# EAGLE schematic Mtx12BR_v1.1 (EAGLE 7.5.0)
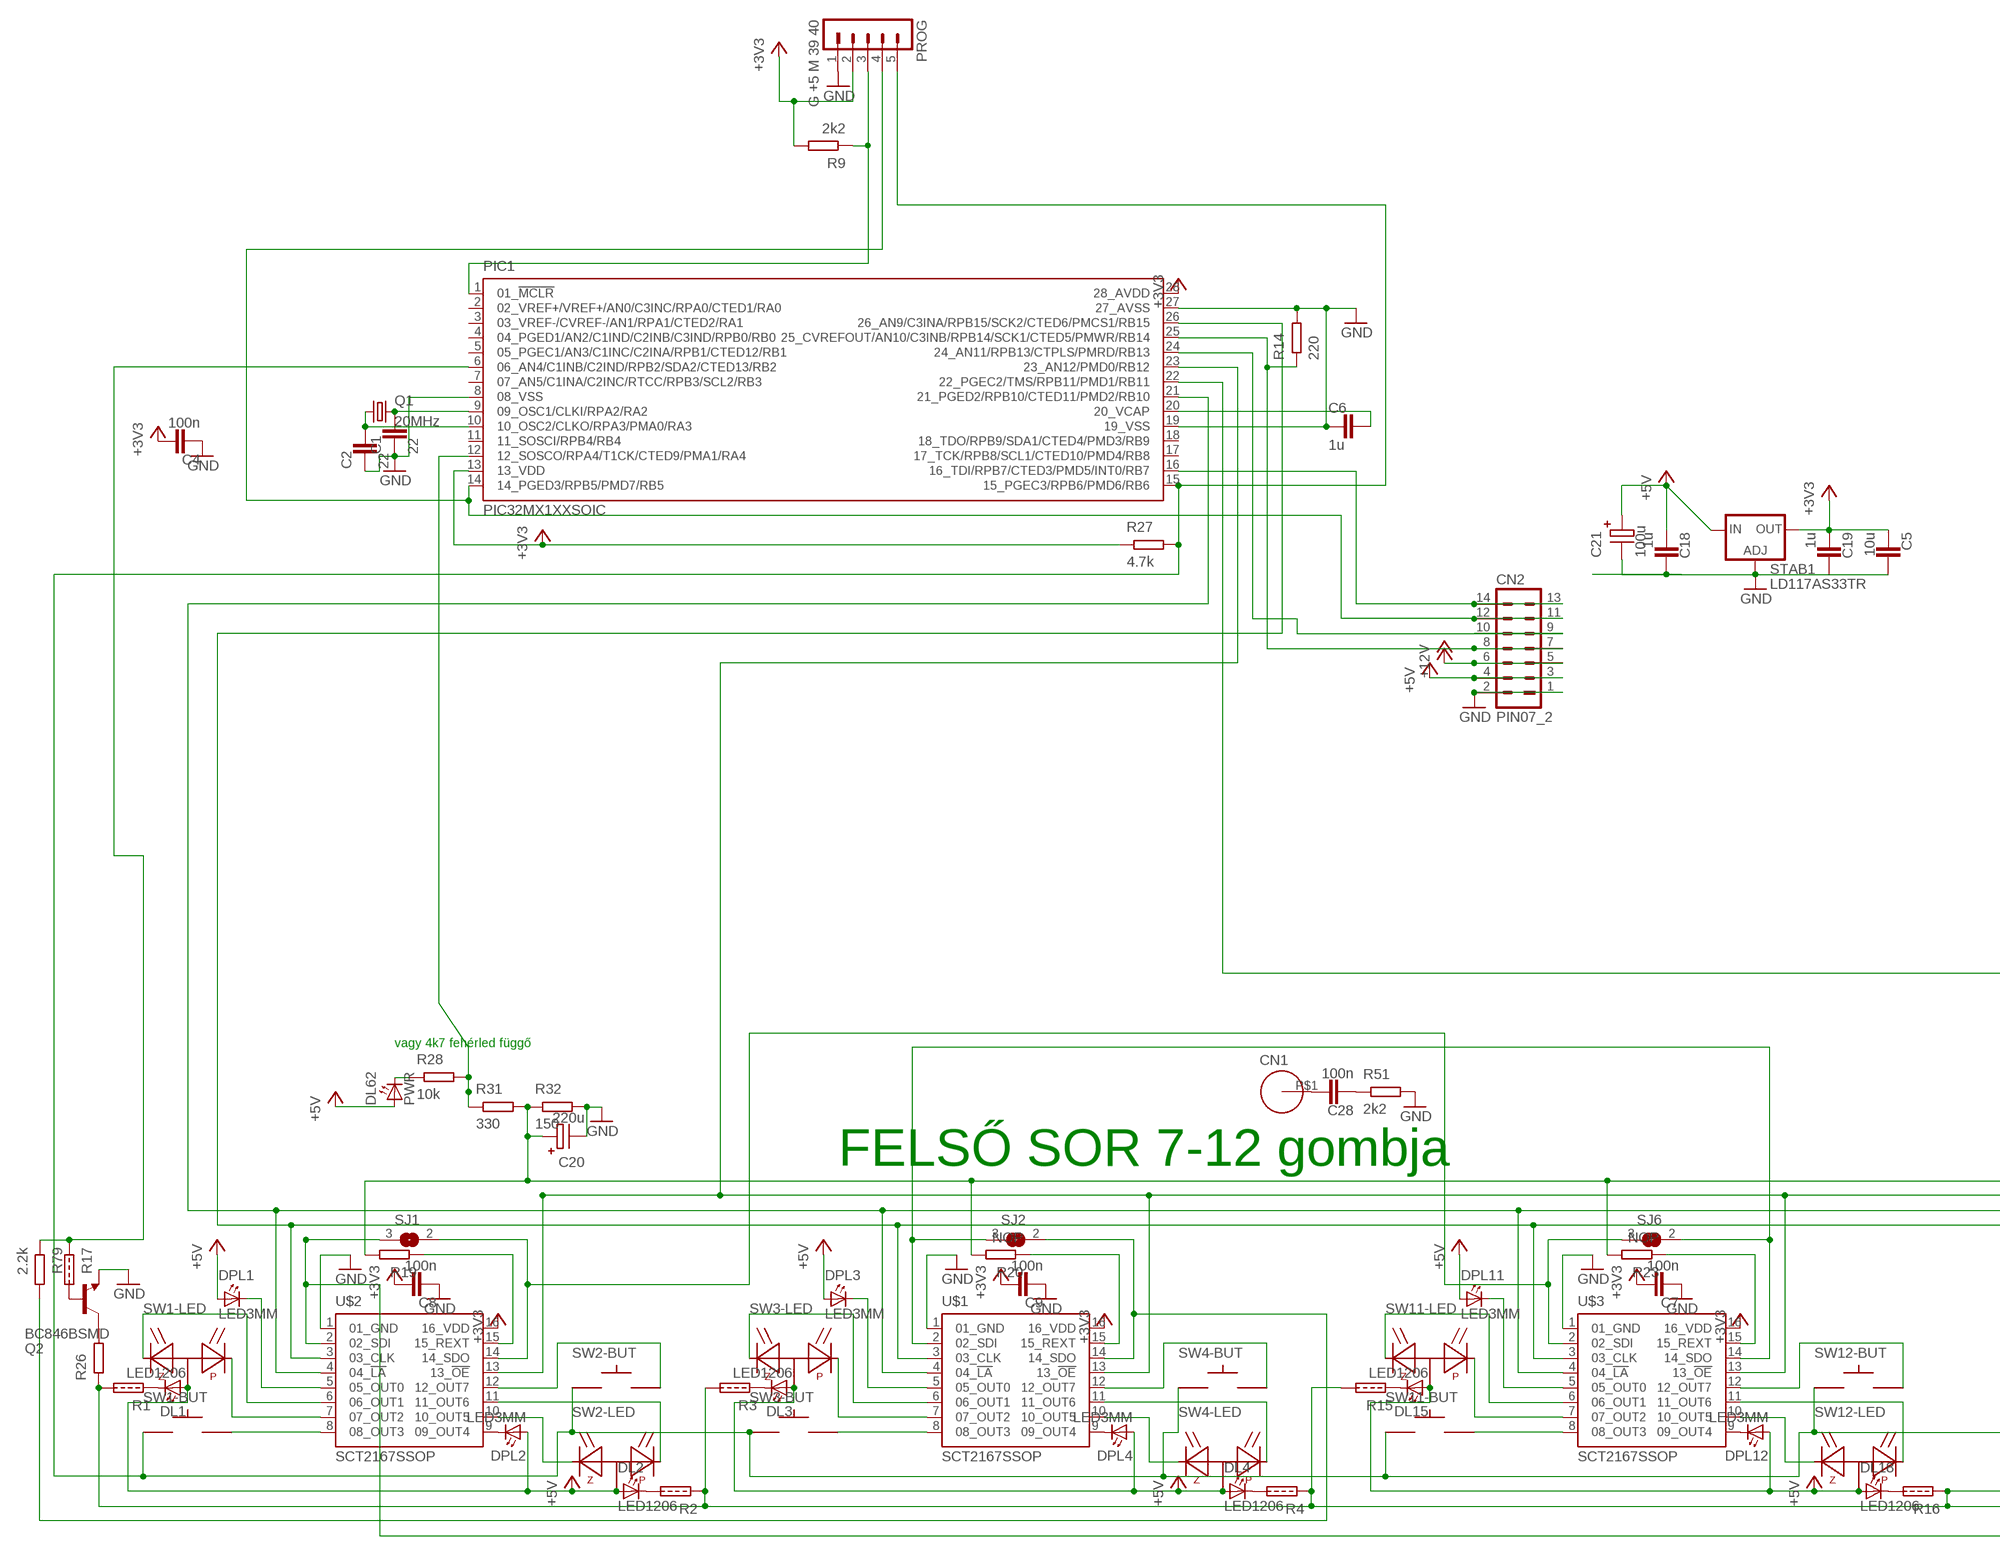
[diagram p0: schematic, sheet 1, part 1 of 2]
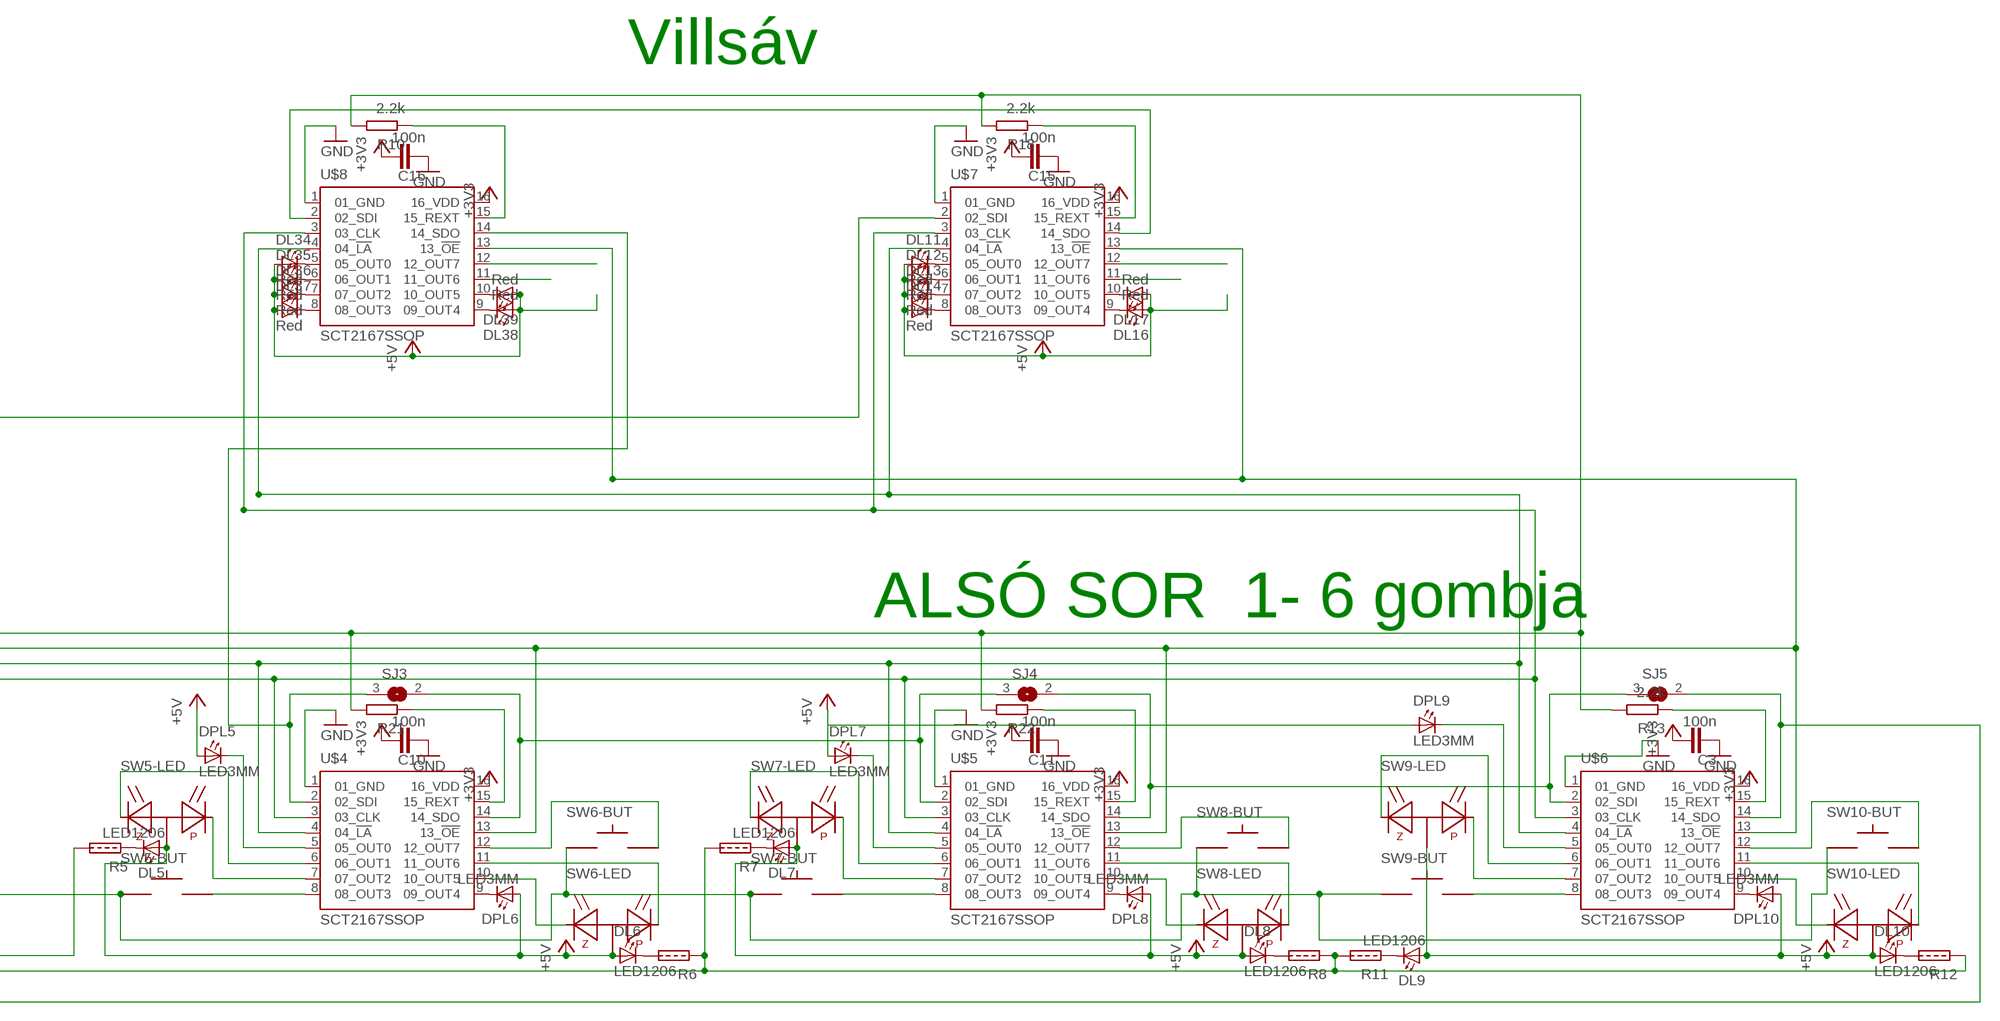
[diagram p1: schematic, sheet 1, part 2 of 2]

## Parts
C1  22  C0805  [R0805]
C2  22  C0805  [R0805]
C3  100n  C0805  [R0805]
C4  100n  C0805  [R0805]
C5  10u  C0805  [R0805]
C6  1u  C0805  [R0805]
C7  100n  C0805  [R0805]
C8  100n  C0805  [R0805]
C9  100n  C0805  [R0805]
C10  100n  C0805  [R0805]
C11  100n  C0805  [R0805]
C15  100n  C0805  [R0805]
C16  100n  C0805  [R0805]
C18  1u  C0805  [R0805]
C19  1u  C0805  [R0805]
C20  220u  C_EL1R07  [C_EL1RASZT07]
C21  100u  C_EL1R07  [C_EL1RASZT07]
C28  100n  C0805  [R0805]
CN1  TESTCSAVAR3.5  [TESTCSAVAR_3.5]
CN2  PIN07_2  [PIN07_2]
DL1  LED1206  [R1206]
DL2  LED1206  [R1206]
DL3  LED1206  [R1206]
DL4  LED1206  [R1206]
DL5  LED1206  [R1206]
DL6  LED1206  [R1206]
DL7  LED1206  [R1206]
DL8  LED1206  [R1206]
DL9  LED1206  [R1206]
DL10  LED1206  [R1206]
DL11  Red  LED5MM  [LED5MM]
DL12  Red  LED5MM  [LED5MM]
DL13  Red  LED5MM  [LED5MM]
DL14  Red  LED5MM  [LED5MM]
DL15  LED1206  [R1206]
DL16  Red  LED5MM  [LED5MM]
DL17  Red  LED5MM  [LED5MM]
DL18  LED1206  [R1206]
DL34  Red  LED5MM  [LED5MM]
DL35  Red  LED5MM  [LED5MM]
DL36  Red  LED5MM  [LED5MM]
DL37  Red  LED5MM  [LED5MM]
DL38  Red  LED5MM  [LED5MM]
DL39  Red  LED5MM  [LED5MM]
DL62  PWR  LED5MM  [LED5MM]
DPL1  LED3MM  [LED3MM]
DPL2  LED3MM  [LED3MM]
DPL3  LED3MM  [LED3MM]
DPL4  LED3MM  [LED3MM]
DPL5  LED3MM  [LED3MM]
DPL6  LED3MM  [LED3MM]
DPL7  LED3MM  [LED3MM]
DPL8  LED3MM  [LED3MM]
DPL9  LED3MM  [LED3MM]
DPL10  LED3MM  [LED3MM]
DPL11  LED3MM  [LED3MM]
DPL12  LED3MM  [LED3MM]
PIC1  PIC32MX1XXSOIC  [SOIC127P1032X265-28N]
PROG  G +5 M 39 40  PIN05_1  [PIN05_1]
Q1  20MHz  XTAL_2NAGYSMD  [XTAL_NAGYSMD]
Q2  BC846BSMD  [SOT23]
R1  RNULL_EU0805  [R0805_C]
R2  RNULL_EU0805  [R0805_C]
R3  RNULL_EU0805  [R0805_C]
R4  RNULL_EU0805  [R0805_C]
R5  RNULL_EU0805  [R0805_C]
R6  RNULL_EU0805  [R0805_C]
R7  RNULL_EU0805  [R0805_C]
R8  RNULL_EU0805  [R0805_C]
R9  2k2  R_EU0805  [R0805]
R10  2.2k  R_EU0805  [R0805]
R11  RNULL_EU0805  [R0805_C]
R12  RNULL_EU0805  [R0805_C]
R13  2.2k  R_EU0805  [R0805]
R14  220  R_EU0805  [R0805]
R15  RNULL_EU0805  [R0805_C]
R16  RNULL_EU0805  [R0805_C]
R17  RNULL_EU0805  [R0805_C]
R18  2.2k  R_EU0805  [R0805]
R19  R_EU0805  [R0805]
R20  NOP  R_EU0805  [R0805]
R21  R_EU0805  [R0805]
R22  R_EU0805  [R0805]
R23  NOP  R_EU0805  [R0805]
R26  R_EU0805  [R0805]
R27  4.7k  R_EU0805  [R0805]
R28  10k  R_EU0805  [R0805]
R31  330  R_EU0805  [R0805]
R32  150  R_EU0805  [R0805]
R51  2k2  R_EU0805  [R0805]
R79  2.2k  R_EU0805  [R0805]
SJ1  SJ  [SJ]
SJ2  SJ  [SJ]
SJ3  SJ  [SJ]
SJ4  SJ  [SJ]
SJ5  SJ  [SJ]
SJ6  SJ  [SJ]
STAB1  LD117AS33TR  [SOT223]
SW1  SPG2  [SPG2_3LED]
SW2  SPG2  [SPG2_3LED]
SW3  SPG2  [SPG2_3LED]
SW4  SPG2  [SPG2_3LED]
SW5  SPG2  [SPG2_3LED]
SW6  SPG2  [SPG2_3LED]
SW7  SPG2  [SPG2_3LED]
SW8  SPG2  [SPG2_3LED]
SW9  SPG2  [SPG2_3LED]
SW10  SPG2  [SPG2_3LED]
SW11  SPG2  [SPG2_3LED]
SW12  SPG2  [SPG2_3LED]
U$1  SCT2167SSOP  [SSOP]
U$2  SCT2167SSOP  [SSOP]
U$3  SCT2167SSOP  [SSOP]
U$4  SCT2167SSOP  [SSOP]
U$5  SCT2167SSOP  [SSOP]
U$6  SCT2167SSOP  [SSOP]
U$7  SCT2167SSOP  [SSOP]
U$8  SCT2167SSOP  [SSOP]

## Nets
+3V3: C3.1 C4.1 C5.2 C7.1 C8.1 C9.1 C10.1 C11.1 C15.1 C16.1 C19.2 PIC1.13(13_VDD) PIC1.28(28_AVDD) PROG.2 R9.2(E) R27.1(A) STAB1.4(OUT) U$1.16(16_VDD) U$2.16(16_VDD) U$3.16(16_VDD) U$4.16(16_VDD) U$5.16(16_VDD) U$6.16(16_VDD) U$7.16(16_VDD) U$8.16(16_VDD)
+5V: C18.2 C21.P+ CN2.3 CN2.4 DL1.1(A) DL2.1(A) DL3.1(A) DL4.1(A) DL5.1(A) DL6.1(A) DL7.1(A) DL8.1(A) DL9.1(A) DL10.1(A) DL11.A DL12.A DL13.A DL14.A DL15.1(A) DL16.A DL17.A DL18.1(A) DL34.A DL35.A DL36.A DL37.A DL38.A DL39.A DL62.A DPL1.A DPL2.A DPL3.A DPL4.A DPL5.A DPL6.A DPL7.A DPL8.A DPL9.A DPL10.A DPL11.A DPL12.A STAB1.3(IN) SW1.LED+(-LED:+) SW2.LED+(-LED:+) SW3.LED+(-LED:+) SW4.LED+(-LED:+) SW5.LED+(-LED:+) SW6.LED+(-LED:+) SW7.LED+(-LED:+) SW8.LED+(-LED:+) SW9.LED+(-LED:+) SW10.LED+(-LED:+) SW11.LED+(-LED:+) SW12.LED+(-LED:+)
+12V: CN2.5 CN2.6
GND [Tap]: C1.2 C2.2 C3.2 C4.2 C5.1 C6.2 C7.2 C8.2 C9.2 C10.2 C11.2 C15.2 C16.2 C18.1 C19.1 C20.P- C21.P- CN2.1 CN2.2 PIC1.8(08_VSS) PIC1.19(19_VSS) PIC1.27(27_AVSS) PROG.1 Q2.2(E) R14.2(E) R32.2(E) R51.2(E) STAB1.1(ADJ) U$1.1(01_GND) U$2.1(01_GND) U$3.1(01_GND) U$4.1(01_GND) U$5.1(01_GND) U$6.1(01_GND) U$7.1(01_GND) U$8.1(01_GND)
N$1: C1.1 PIC1.9(09_OSC1/CLKI/RPA2/RA2) Q1.P$2
N$2: C2.1 PIC1.10(10_OSC2/CLKO/RPA3/PMA0/RA3) Q1.P$1
N$3: C20.P+ R10.2(E) R13.2(E) R18.2(E) R19.2(E) R20.2(E) R21.2(E) R22.2(E) R23.2(E) R31.2(E) R32.1(A)
N$4: SW5.G2(-BUT:G2) U$4.8(08_OUT3)
N$5: SW9.P-(-LED:P) U$6.7(07_OUT2)
N$6: DPL4.K(C) U$1.9(09_OUT4)
N$7: SW5.P-(-LED:P) U$4.7(07_OUT2)
N$8: DPL12.K(C) U$3.9(09_OUT4)
N$9: Q2.1(B) R17.2(E)
N$10: SW6.Z-(-LED:Z) U$4.10(10_OUT5)
N$11: SW5.Z-(-LED:Z) U$4.6(06_OUT1)
N$12: SW6.P-(-LED:P) U$4.11(11_OUT6)
N$13: SW9.Z-(-LED:Z) U$6.6(06_OUT1)
N$14: SW6.G2(-BUT:G2) U$4.12(12_OUT7)
N$15: SW10.Z-(-LED:Z) U$6.10(10_OUT5)
N$16: SW10.P-(-LED:P) U$6.11(11_OUT6)
N$17: DPL5.K(C) U$4.5(05_OUT0)
N$18: DL6.2(C) R6.2(E)
N$19: DPL6.K(C) U$4.9(09_OUT4)
N$20: DL5.2(C) R5.1(A)
N$21: R18.1(A) U$7.15(15_REXT)
N$22: SW10.G2(-BUT:G2) U$6.12(12_OUT7)
N$23: DL1.2(C) R1.1(A)
N$24: DPL2.K(C) U$2.9(09_OUT4)
N$25: DL2.2(C) R2.2(E)
N$26: SW9.G2(-BUT:G2) U$6.8(08_OUT3)
N$27: SW3.P-(-LED:P) U$1.7(07_OUT2)
N$28: SW3.Z-(-LED:Z) U$1.6(06_OUT1)
N$29: SW1.P-(-LED:P) U$2.7(07_OUT2)
N$30: SW1.Z-(-LED:Z) U$2.6(06_OUT1)
N$31: SW2.Z-(-LED:Z) U$2.10(10_OUT5)
N$32: SW2.P-(-LED:P) U$2.11(11_OUT6)
N$33: PIC1.6(06_AN4/C1INB/C2IND/RPB2/SDA2/CTED13/RB2) R17.1(A) R79.1(A)
N$34: DL62.K(C) R28.1(A)
N$37: R10.1(A) U$8.15(15_REXT)
N$38: DPL8.K(C) U$5.9(09_OUT4)
N$39: DPL10.K(C) U$6.9(09_OUT4)
N$40: DL11.K(C) U$7.5(05_OUT0)
N$41: PIC1.1(01_!MCLR!) PROG.3 R9.1(A)
N$43: SW2.G2(-BUT:G2) U$2.12(12_OUT7)
N$46: DL12.K(C) U$7.6(06_OUT1)
N$47: DPL9.K(C) U$6.5(05_OUT0)
N$48: DL13.K(C) U$7.7(07_OUT2)
N$49: SJ4.2 SJ5.3 U$5.14(14_SDO) U$6.2(02_SDI)
N$50: SW1.G2(-BUT:G2) U$2.8(08_OUT3)
N$51: DL10.2(C) R12.2(E)
N$52: U$7.11(11_OUT6)
N$53: PIC1.22(22_PGEC2/TMS/RPB11/PMD1/RB11) U$7.2(02_SDI)
N$54: U$7.14(14_SDO) U$8.2(02_SDI)
N$55: U$7.12(12_OUT7)
N$56: DL9.2(C) R11.1(A)
N$57: SJ1.3 SJ5.2 U$2.2(02_SDI) U$6.14(14_SDO)
N$58: DPL1.K(C) U$2.5(05_OUT0)
N$59: SW4.Z-(-LED:Z) U$1.10(10_OUT5)
N$60: R13.1(A) U$6.15(15_REXT)
N$61: DL14.K(C) U$7.8(08_OUT3)
N$62: C6.1 PIC1.20(20_VCAP)
N$63: SJ1.2 SJ6.3 U$2.14(14_SDO) U$3.2(02_SDI)
N$64: SW4.P-(-LED:P) U$1.11(11_OUT6)
N$65: SW4.G2(-BUT:G2) U$1.12(12_OUT7)
N$66: SW3.G2(-BUT:G2) U$1.8(08_OUT3)
N$67: DPL3.K(C) U$1.5(05_OUT0)
N$68: U$8.12(12_OUT7)
N$69: U$8.11(11_OUT6)
N$70: SW7.P-(-LED:P) U$5.7(07_OUT2)
N$71: Q2.3(C) R26.2(E)
N$72: PIC1.12(12_SOSCO/RPA4/T1CK/CTED9/PMA1/RA4) R28.2(E) R31.1(A)
N$73: DL16.K(C) U$7.9(09_OUT4)
N$74: SW7.Z-(-LED:Z) U$5.6(06_OUT1)
N$75: SW8.Z-(-LED:Z) U$5.10(10_OUT5)
N$76: SW8.P-(-LED:P) U$5.11(11_OUT6)
N$77: SW8.G2(-BUT:G2) U$5.12(12_OUT7)
N$78: SW7.G2(-BUT:G2) U$5.8(08_OUT3)
N$79: DPL7.K(C) U$5.5(05_OUT0)
N$80: C28.1 CN1.P$1
N$81: SJ2.3 SJ6.2 U$1.2(02_SDI) U$3.14(14_SDO)
N$82: DL17.K(C) U$7.10(10_OUT5)
N$83: DL3.2(C) R3.1(A)
N$84: DL4.2(C) R4.2(E)
N$85: R19.1(A) U$2.15(15_REXT)
N$86: DL34.K(C) U$8.5(05_OUT0)
N$87: R20.1(A) U$1.15(15_REXT)
N$88: R21.1(A) U$4.15(15_REXT)
N$89: R22.1(A) U$5.15(15_REXT)
N$90: DL35.K(C) U$8.6(06_OUT1)
N$91: DL36.K(C) U$8.7(07_OUT2)
N$92: DL37.K(C) U$8.8(08_OUT3)
N$96: DL38.K(C) U$8.9(09_OUT4)
N$99: DL39.K(C) U$8.10(10_OUT5)
N$100: DL7.2(C) R7.1(A)
N$101: DL8.2(C) R8.2(E)
N$102: SW11.P-(-LED:P) U$3.7(07_OUT2)
N$103: SW11.Z-(-LED:Z) U$3.6(06_OUT1)
N$104: SW12.Z-(-LED:Z) U$3.10(10_OUT5)
N$105: SW12.P-(-LED:P) U$3.11(11_OUT6)
N$106: SW12.G2(-BUT:G2) U$3.12(12_OUT7)
N$107: SW11.G2(-BUT:G2) U$3.8(08_OUT3)
N$108: DPL11.K(C) U$3.5(05_OUT0)
N$110: DL15.2(C) R15.1(A)
N$111: DL18.2(C) R16.2(E)
N$112: R23.1(A) U$3.15(15_REXT)
N$115: R79.2(E) SJ2.2 U$1.14(14_SDO)
N$130: C28.2 R51.1(A)
N$158: SJ3.2 SJ4.3 U$4.14(14_SDO) U$5.2(02_SDI)
N$334: R1.2(E) R2.1(A) R3.2(E) R4.1(A) R5.2(E) R6.1(A) R7.2(E) R8.1(A) R11.2(E) R12.1(A) R15.2(E) R16.1(A) R26.1(A)
N$369: PIC1.23(23_AN12/PMD0/RB12) U$1.13(13_!OE!) U$2.13(13_!OE!) U$3.13(13_!OE!) U$4.13(13_!OE!) U$5.13(13_!OE!) U$6.13(13_!OE!) U$7.13(13_!OE!) U$8.13(13_!OE!)
SCK1: CN2.7 CN2.8 PIC1.25(25_CVREFOUT/AN10/C3INB/RPB14/SCK1/CTED5/PMWR/RB14) R14.1(A)
SCK3: PIC1.26(26_AN9/C3INA/RPB15/SCK2/CTED6/PMCS1/RB15) U$1.3(03_CLK) U$2.3(03_CLK) U$3.3(03_CLK) U$4.3(03_CLK) U$5.3(03_CLK) U$6.3(03_CLK) U$7.3(03_CLK) U$8.3(03_CLK)
SDI1: CN2.11 CN2.12 PIC1.14(14_PGED3/RPB5/PMD7/RB5) PROG.4
SDI3: PIC1.15(15_PGEC3/RPB6/PMD6/RB6) PROG.5 R27.2(E) SW1.G1(-BUT:G1) SW2.G1(-BUT:G1) SW3.G1(-BUT:G1) SW4.G1(-BUT:G1) SW5.G1(-BUT:G1) SW6.G1(-BUT:G1) SW7.G1(-BUT:G1) SW8.G1(-BUT:G1) SW9.G1(-BUT:G1) SW10.G1(-BUT:G1) SW11.G1(-BUT:G1) SW12.G1(-BUT:G1)
SDO1: CN2.9 CN2.10 PIC1.24(24_AN11/RPB13/CTPLS/PMRD/RB13)
SDO2: SJ3.3 U$4.2(02_SDI) U$8.14(14_SDO)
SS1: CN2.13 CN2.14 PIC1.16(16_TDI/RPB7/CTED3/PMD5/INT0/RB7)
SS3: PIC1.21(21_PGED2/RPB10/CTED11/PMD2/RB10) U$1.4(04_!LA!) U$2.4(04_!LA!) U$3.4(04_!LA!) U$4.4(04_!LA!) U$5.4(04_!LA!) U$6.4(04_!LA!) U$7.4(04_!LA!) U$8.4(04_!LA!)
Unconnected: PIC1.2(02_VREF+/VREF+/AN0/C3INC/RPA0/CTED1/RA0) PIC1.3(03_VREF-/CVREF-/AN1/RPA1/CTED2/RA1) PIC1.4(04_PGED1/AN2/C1IND/C2INB/C3IND/RPB0/RB0) PIC1.5(05_PGEC1/AN3/C1INC/C2INA/RPB1/CTED12/RB1) PIC1.7(07_AN5/C1INA/C2INC/RTCC/RPB3/SCL2/RB3) PIC1.11(11_SOSCI/RPB4/RB4) PIC1.17(17_TCK/RPB8/SCL1/CTED10/PMD4/RB8) PIC1.18(18_TDO/RPB9/SDA1/CTED4/PMD3/RB9)

## Notes on the sheet
- Villsáv
- vagy 4k7 fehérled függő
- FELSŐ SOR 7-12 gombja | ALSÓ SOR  1- 6 gombja

## Library data of the parts
C1-C11 C15 C16 C18 C19 C28 = Cf_RLCPX:C
C20 C21 = Cf_RLCPX:C_EL
CN1 = Cf_Csatl:TESTCSAVAR
CN2 = Cf_Csatl:PIN07_2
DL1-DL18 DL34-DL39 DL62 DPL1-DPL12 = Cf_Felv:LED
PIC1 = Narvalex:PIC32MX1XX
PROG = Cf_Csatl:PIN05_1
Q1 = Cf_RLCPX:XTAL_2
Q2 = narval:BC846*: NPN Transistor
R1-R8 R11 R12 R15-R17 = Cf_RLCPX:RNULL_EU
R9 R10 R13 R14 R18-R23 R26-R28 R31 R32 R51 R79 = Cf_RLCPX:R_EU
SJ1-SJ6 = jumper:SJ: SMD solder JUMPER
STAB1 = narval:LD117A?*: Low drop fixed and adjustable positive voltage regulators 1 A Source: http://www.st.com/stonline/products/literature/ds/7194/ld1117axx.pdf
SW1-SW12 = narval:SPG2
U$1-U$8 = SCT2167:SCT2167

## Net classes
0 default: width 0.305 mm, clearance 0.203 mm
1 Tap: width 0.406 mm, clearance 0.203 mm